# EAGLE schematic theremin-oscillator (EAGLE 6.0)
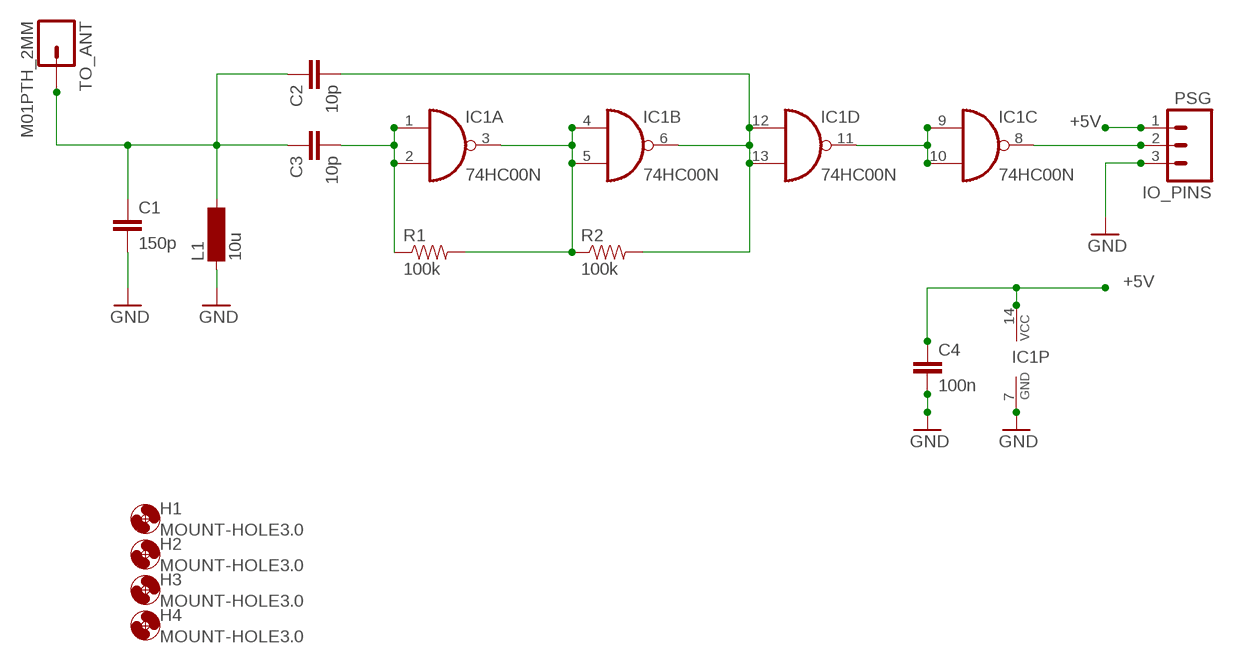
[diagram p0: schematic, sheet 1]

## Parts
C1  150p  CAPPTH  [CAP-PTH-SMALL]
C2  10p  CAPPTH  [CAP-PTH-SMALL]
C3  10p  CAPPTH  [CAP-PTH-SMALL]
C4  100n  CAPPTH  [CAP-PTH-SMALL]
H1  MOUNT-HOLE3.0  [3,0]
H2  MOUNT-HOLE3.0  [3,0]
H3  MOUNT-HOLE3.0  [3,0]
H4  MOUNT-HOLE3.0  [3,0]
IC1  74HC00N  [DIL14]
IO_PINS  PSG  M03PTH  [1X03]
L1  10u  BS11  [BS11]
R1  100k  RESISTORPTH-1/4W  [AXIAL-0.4]
R2  100k  RESISTORPTH-1/4W  [AXIAL-0.4]
TO_ANT  M01PTH_2MM  [1X01_2MM]

## Nets
+5V: C4.1 IC1.14(P:VCC) IO_PINS.1
GND: C1.2 C4.2 IC1.7(P:GND) IO_PINS.3 L1.1
N$1: C3.2 IC1.1(A:I0) IC1.2(A:I1) R1.P$1
N$2: IC1.3(A:O) IC1.4(B:I0) IC1.5(B:I1) R1.P$2 R2.P$1
N$4: C2.2 IC1.6(B:O) IC1.12(D:I0) IC1.13(D:I1) R2.P$2
N$5: C1.1 C2.1 C3.1 L1.2 TO_ANT.1
N$6: IC1.9(C:I0) IC1.10(C:I1) IC1.11(D:O)
N$7: IC1.8(C:O) IO_PINS.2

## Library data of the parts
C1-C4 = SparkFun:CAP: Capacitor Standard 0603 ceramic capacitor, and 0.1" leaded capacitor.
H1-H4 = holes:MOUNT-HOLE: MOUNTING HOLE with drill center marker
IC1 = 74xx-eu:74*00: Quad 2-input NAND gate
IO_PINS = SparkFun:M03: Header 3 Standard 3-pin 0.1" header. Use with straight break away headers (SKU : PRT-00116), right angle break away headers (PRT-00553), swiss pins (PRT-00743), machine pins (PRT-00117), and female headers (PRT-00115). Molex polarized connector foot print use with SKU : PRT-08232 with associated crimp pins and housings.
L1 = inductor-neosid:BS: INDUCTOR nominal inductance, magnetically screened; OC_FARNELL: unknown; OC_NEWARK: unknown
R1 R2 = SparkFun:RESISTOR: Resistor Basic schematic elements and footprints for 0603, 1206, and PTH resistors.
TO_ANT = SparkFun:M01: Header 1 Standard 1-pin 0.1" header. Use with straight break away headers (SKU : PRT-00116), right angle break away headers (PRT-00553), swiss pins (PRT-00743), machine pins (PRT-00117), and female headers (PRT-00115).